# Altium schematic sheet IP Camera v0.0.1_periphery.SchDoc
size 427 x 301 mm; Organization: нижняя строка названия; Address1: Прошутинский; Address2: Шелестов; Address3: Н.Контр; Address4: Утвердил; DocumentNumber: IP камера Э3; SheetNumber: 1; SheetTotal: 5; Address5: МГТУ им. Н. Э. Баумана; Address6: Кафедра РЛ2; Address7: Группа РЛ2-81; Scale: 1:1
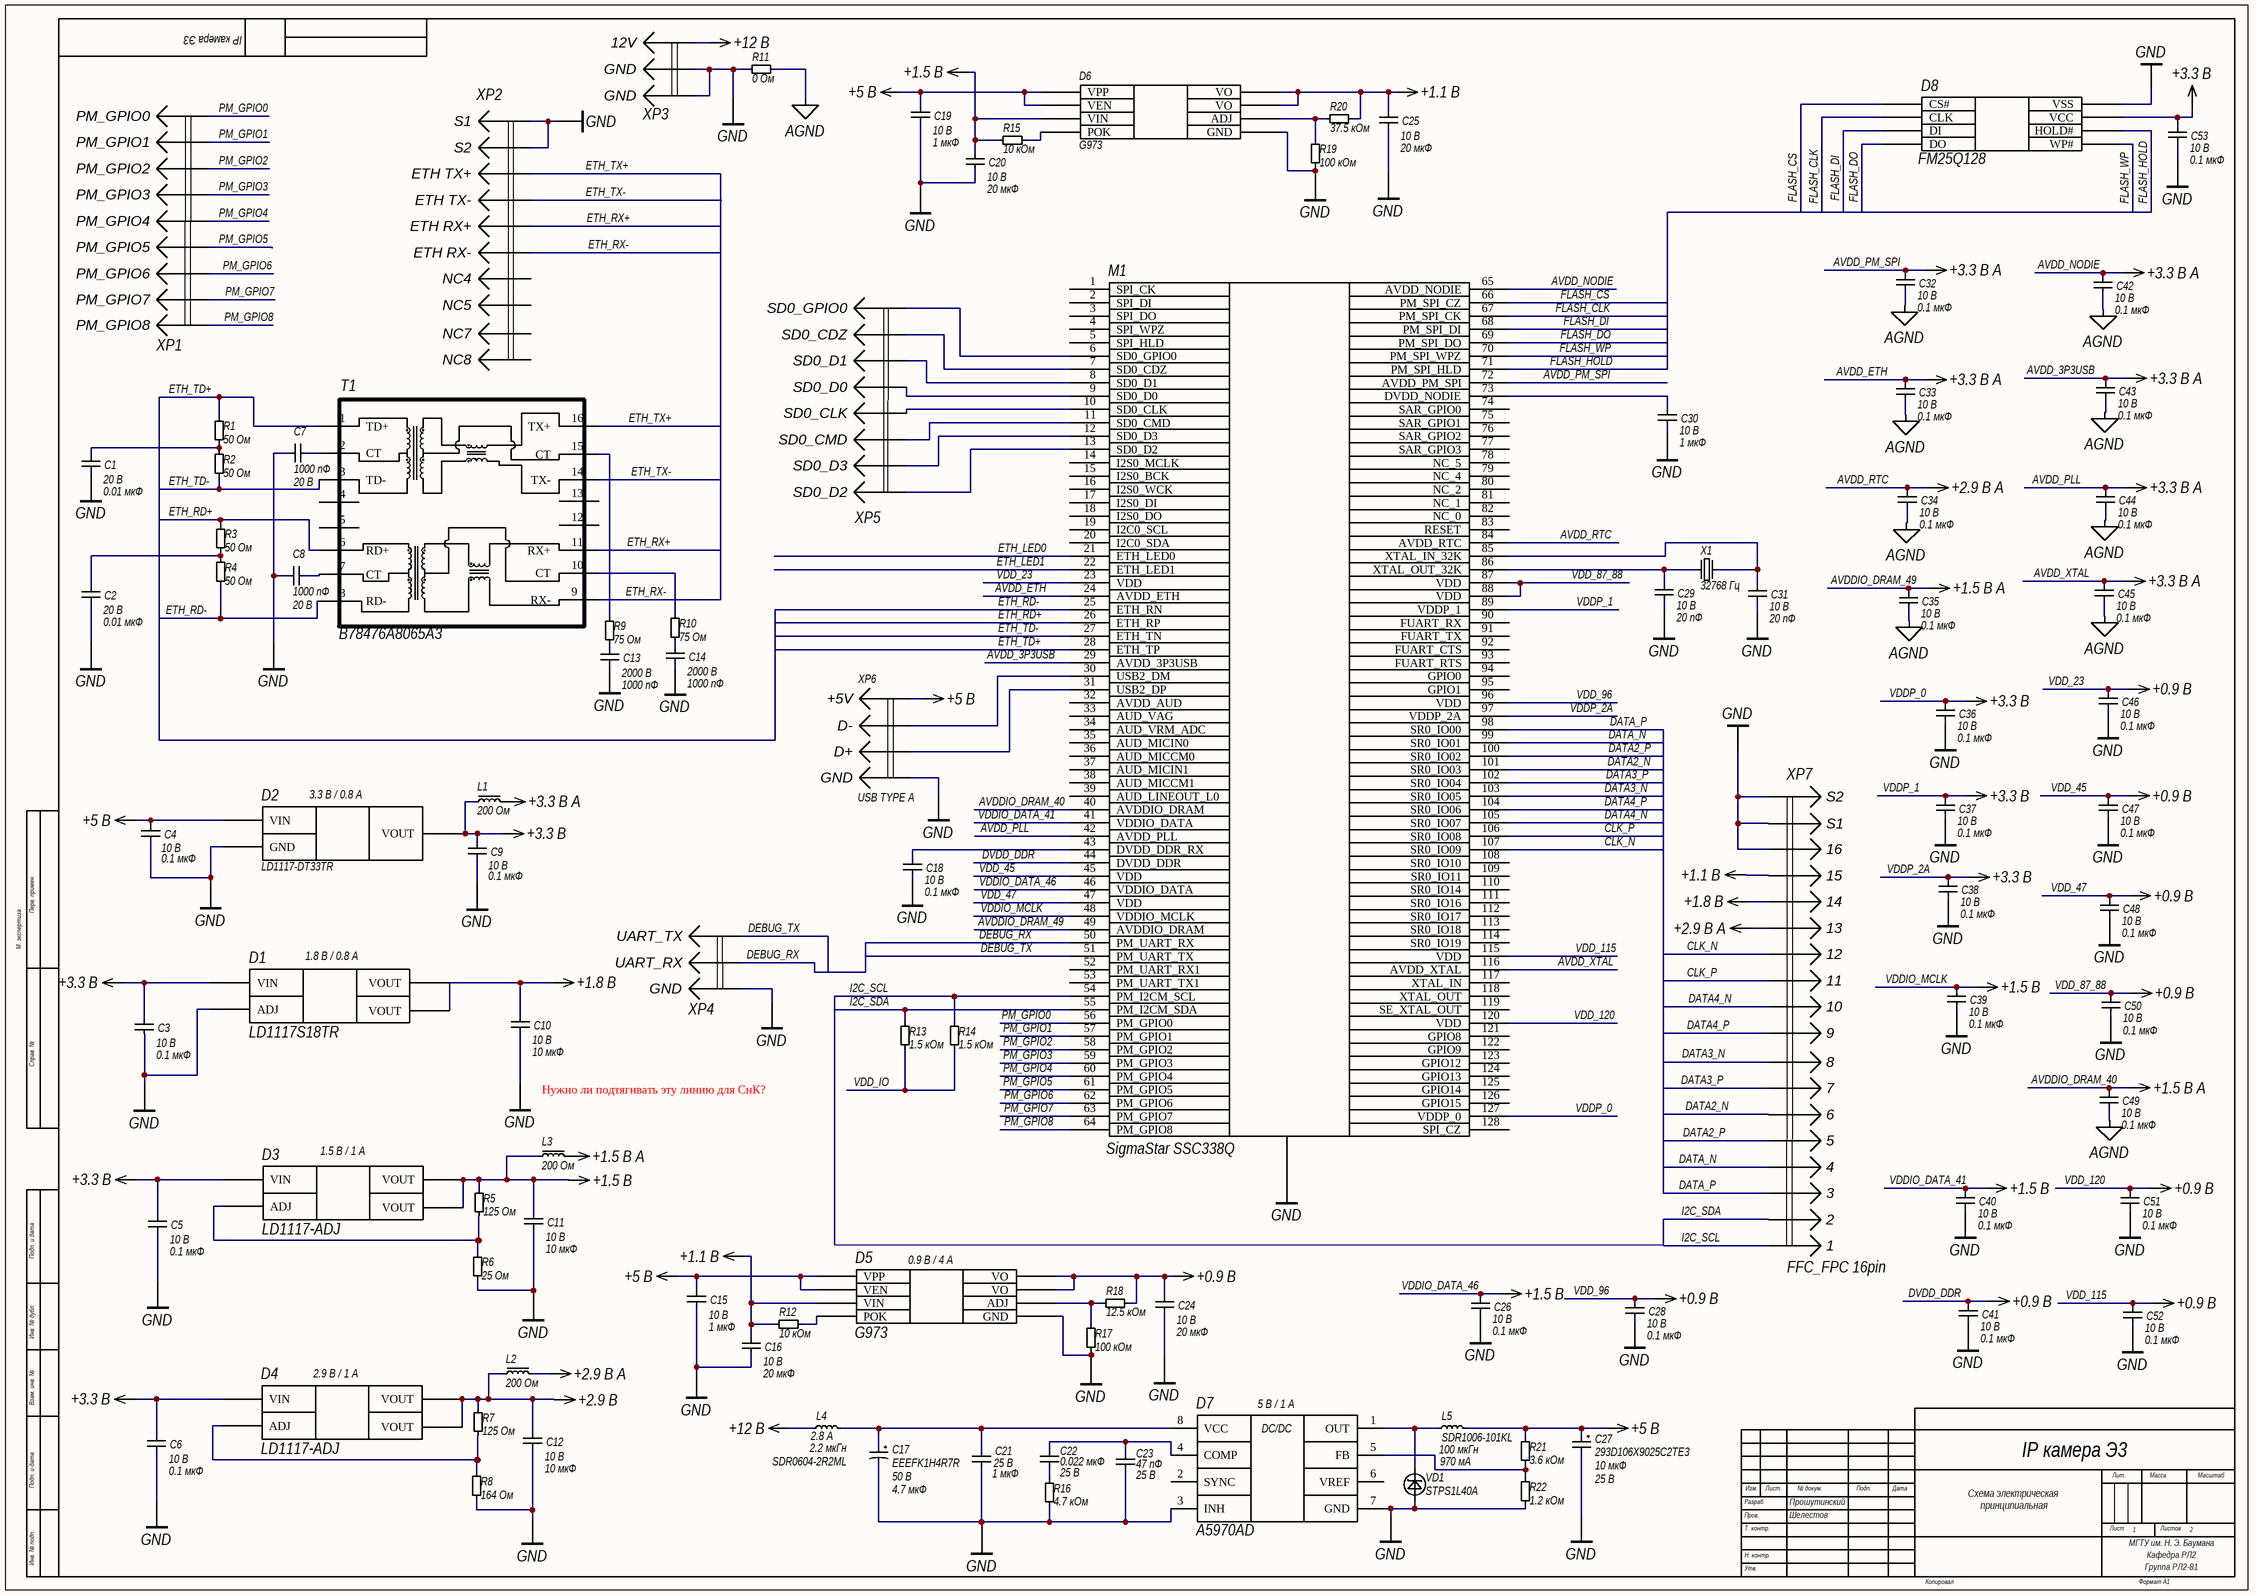
[diagram p0: IP Camera v0.0.1_periphery.SchDoc]

## Parts
C1  Voltage: 20 В  [CAP0603]  (hidden comment: 0.01 мкФ)
C2  Voltage: 20 В  [CAP0603]  (hidden comment: 0.01 мкФ)
C3  Voltage: 10 В  [CAP0603]  (hidden comment: 0.1 мкФ)
C4  Voltage: 10 В  [CAP0603]  (hidden comment: 0.1 мкФ)
C5  Voltage: 10 В  [CAP0603]  (hidden comment: 0.1 мкФ)
C6  Voltage: 10 В  [CAP0603]  (hidden comment: 0.1 мкФ)
C7  Voltage: 20 В  [CAP0603]  (hidden comment: 1000 пФ)
C8  Voltage: 20 В  [CAP0603]  (hidden comment: 1000 пФ)
C9  Voltage: 10 В  [CAP0603]  (hidden comment: 0.1 мкФ)
C10  Voltage: 10 В  [CAP0603]  (hidden comment: 10 мкФ)
C11  Voltage: 10 В  [CAP0603]  (hidden comment: 10 мкФ)
C12  Voltage: 10 В  [CAP0603]  (hidden comment: 10 мкФ)
C13  Voltage: 2000 В  [CAP0603]  (hidden comment: 1000 пФ)
C14  Voltage: 2000 В  [CAP0603]  (hidden comment: 1000 пФ)
C15  Voltage: 10 В  [CAP0603]  (hidden comment: 1 мкФ)
C16  Voltage: 10 В  [CAP0603]  (hidden comment: 20 мкФ)
C17  EEEFK1H4R7R  Voltage: 50 В  Capacity: 4.7 мкФ  [EEEFK1H4R7R]
C18  Voltage: 10 В  [CAP0603]  (hidden comment: 0.1 мкФ)
C19  Voltage: 10 В  [CAP0603]  (hidden comment: 1 мкФ)
C20  Voltage: 10 В  [CAP0603]  (hidden comment: 20 мкФ)
C21  Voltage: 25 В  [CAP0603]  (hidden comment: 1 мкФ)
C22  Voltage: 25 В  [CAP0603]  (hidden comment: 0.022 мкФ)
C23  Voltage: 25 В  [CAP0603]  (hidden comment: 47 пФ)
C24  Voltage: 10 В  [CAP0603]  (hidden comment: 20 мкФ)
C25  Voltage: 10 В  [CAP0603]  (hidden comment: 20 мкФ)
C26  Voltage: 10 В  [CAP0603]  (hidden comment: 0.1 мкФ)
C27  293D106X9025C2TE3  Capacity: 10 мкФ  Voltage: 25 В  [TANTAL C]
C28  Voltage: 10 В  [CAP0603]  (hidden comment: 0.1 мкФ)
C29  Voltage: 10 В  [CAP0603]  (hidden comment: 20 пФ)
C30  Voltage: 10 В  [CAP0603]  (hidden comment: 1 мкФ)
C31  Voltage: 10 В  [CAP0603]  (hidden comment: 20 пФ)
C32  Voltage: 10 В  [CAP0603]  (hidden comment: 0.1 мкФ)
C33  Voltage: 10 В  [CAP0603]  (hidden comment: 0.1 мкФ)
C34  Voltage: 10 В  [CAP0603]  (hidden comment: 0.1 мкФ)
C35  Voltage: 10 В  [CAP0603]  (hidden comment: 0.1 мкФ)
C36  Voltage: 10 В  [CAP0603]  (hidden comment: 0.1 мкФ)
C37  Voltage: 10 В  [CAP0603]  (hidden comment: 0.1 мкФ)
C38  Voltage: 10 В  [CAP0603]  (hidden comment: 0.1 мкФ)
C39  Voltage: 10 В  [CAP0603]  (hidden comment: 0.1 мкФ)
C40  Voltage: 10 В  [CAP0603]  (hidden comment: 0.1 мкФ)
C41  Voltage: 10 В  [CAP0603]  (hidden comment: 0.1 мкФ)
C42  Voltage: 10 В  [CAP0603]  (hidden comment: 0.1 мкФ)
C43  Voltage: 10 В  [CAP0603]  (hidden comment: 0.1 мкФ)
C44  Voltage: 10 В  [CAP0603]  (hidden comment: 0.1 мкФ)
C45  Voltage: 10 В  [CAP0603]  (hidden comment: 0.1 мкФ)
C46  Voltage: 10 В  [CAP0603]  (hidden comment: 0.1 мкФ)
C47  Voltage: 10 В  [CAP0603]  (hidden comment: 0.1 мкФ)
C48  Voltage: 10 В  [CAP0603]  (hidden comment: 0.1 мкФ)
C49  Voltage: 10 В  [CAP0603]  (hidden comment: 0.1 мкФ)
C50  Voltage: 10 В  [CAP0603]  (hidden comment: 0.1 мкФ)
C51  Voltage: 10 В  [CAP0603]  (hidden comment: 0.1 мкФ)
C52  Voltage: 10 В  [CAP0603]  (hidden comment: 0.1 мкФ)
C53  Voltage: 10 В  [CAP0603]  (hidden comment: 0.1 мкФ)
D1  LD1117S18TR  [SOT-223]
D2  LD1117-DT33TR  [D-PAK]
D3  LD1117-ADJ  [SOT-223]
D4  LD1117-ADJ  [SOT-223]
D5  G973  [SOP-8]
D6  G973  [SOP-8]
D7  A5970AD  [SOIC-8]
D8  FM25Q128  [SOP-8]
L1  value 200 Ом  [FERRITE0603]  (hidden comment: FERRITE0603)
L2  value 200 Ом  [FERRITE0603]  (hidden comment: FERRITE0603)
L3  value 200 Ом  [FERRITE0603]  (hidden comment: FERRITE0603)
L4  SDR0604-2R2ML  Current: 2.8 А  Inductance: 2.2 мкГн  [SDR0604-2R2ML]
L5  SDR1006-101KL  value 100 мкГн  current: 970 мА  [SDR1006-101KL]
M1  SigmaStar SSC338Q  [QFN-128]
R1  value 50 Ом  [RES0603]  (hidden comment: RES)
R2  value 50 Ом  [RES0603]  (hidden comment: RES)
R3  value 50 Ом  [RES0603]  (hidden comment: RES)
R4  value 50 Ом  [RES0603]  (hidden comment: RES)
R5  value 125 Ом  [RES0603]  (hidden comment: RES)
R6  value 25 Ом  [RES0603]  (hidden comment: RES)
R7  value 125 Ом  [RES0603]  (hidden comment: RES)
R8  value 164 Ом  [RES0603]  (hidden comment: RES)
R9  value 75 Ом  [RES0603]  (hidden comment: RES)
R10  value 75 Ом  [RES0603]  (hidden comment: RES)
R11  value 0 Ом  [RES0603]  (hidden comment: RES)
R12  value 10 кОм  [RES0603]  (hidden comment: RES)
R13  value 1.5 кОм  [RES0603]  (hidden comment: RES)
R14  value 1.5 кОм  [RES0603]  (hidden comment: RES)
R15  value 10 кОм  [RES0603]  (hidden comment: RES)
R16  value 4.7 кОм  [RES0603]  (hidden comment: RES)
R17  value 100 кОм  [RES0603]  (hidden comment: RES)
R18  value 12.5 кОм  [RES0603]  (hidden comment: RES)
R19  value 100 кОм  [RES0603]  (hidden comment: RES)
R20  value 37.5 кОм  [RES0603]  (hidden comment: RES)
R21  value 3.6 кОм  [RES0603]  (hidden comment: RES)
R22  value 1.2 кОм  [RES0603]  (hidden comment: RES)
T1  B78476A8065A3  [SOP-16]
VD1  STPS1L40A  [DO-214AC]
X1  value 32768 Гц  (hidden comment: XTAL)
XP1  J4  [J4]  (value not drawn)
XP2  J1  [RJHSE-5E80]  (value not drawn)
XP3  DS-261A  [DS-261A]  (value not drawn)
XP4  J2  [J2]  (value not drawn)
XP5  J6  [J6]  (value not drawn)
XP6  USB TYPE A  [USB TYPE A]
XP7  FFC_FPC 16pin  [FFC_FPC 16pin]

## Nets
+1.1 В: C16.1 C25.1 D5.5(VIN) D6.3(VO) D6.4(VO) R12.2 R20.2 XP7.15
+1.8 В: C10.1 D1.2(VOUT) D1.4(VOUT) XP7.14
+2.9 В: C12.1 D4.2(VOUT) D4.4(VOUT) L2.1 R7.2
+5 В: C4.1 C15.1 C19.1 C27.1 D2.3(VIN) D5.6(VPP) D5.8(VEN) D6.6(VPP) D6.8(VEN) L5.2 R21.1 XP6.1(+5V)
+12 В: L4.1 XP3.1(12V)
AGND: C32.2 C33.2 C34.2 C35.2 C42.2 C43.2 C44.2 C45.2 C49.2 R11.1
AVDD_3P3USB: C32.1 C33.1 C42.1 C43.1 C44.1 C45.1 L1.2 M1.24(AVDD_ETH) M1.29(AVDD_3P3USB) M1.42(AVDD_PLL) M1.65(AVDD_NODIE) M1.72(AVDD_PM_SPI) M1.116(AVDD_XTAL)  [also labelled +3.3 В А, AVDD_ETH, AVDD_NODIE, AVDD_PLL, AVDD_PM_SPI, AVDD_XTAL]
AVDD_RTC: C34.1 L2.2 M1.84(AVDD_RTC) XP7.13  [also labelled +2.9 В А]
AVDDIO_DRAM_40: C35.1 C49.1 L3.2 M1.40(AVDDIO_DRAM) M1.49(AVDDIO_DRAM)  [also labelled +1.5 В А, AVDDIO_DRAM_49]
DVDD_DDR: C24.1 C28.1 C41.1 C46.1 C47.1 C48.1 C50.1 C51.1 C52.1 D5.3(VO) D5.4(VO) M1.23(VDD) M1.44(DVDD_DDR) M1.45(VDD) M1.47(VDD) M1.87(VDD) M1.88(VDD) M1.96(VDD) M1.115(VDD) M1.120(VDD) R18.2  [also labelled +0.9 В, VDD_115, VDD_120, VDD_23, VDD_45, VDD_47, VDD_87_88, VDD_96]
GND: C1.2 C2.2 C3.2 C4.2 C5.2 C6.2 C7.1 C8.1 C9.2 C10.2 C11.2 C12.2 C13.2 C14.2 C15.2 C16.2 C17.2 C18.2 C19.2 C20.2 C21.2 C23.1 C24.2 C25.2 C26.2 C27.2 C28.2 C29.2 C30.2 C31.2 C36.2 C37.2 C38.2 C39.2 C40.2 C41.2 C46.2 C47.2 C48.2 C50.2 C51.2 C52.2 C53.2 D1.1(ADJ) D2.1(GND) D5.1(GND) D6.1(GND) D7.3(INH) D7.7(GND) D8.4(VSS) M1.129(GND) R6.1 R8.1 R11.2 R16.2 R17.2 R19.2 R22.2 VD1.1 XP2.S1 XP2.S2 XP3.2(GND) XP3.3(GND) XP4.3(GND) XP6.4(GND) XP7.16 XP7.S1 XP7.S2
VDDIO_DATA_41: C11.1 C20.1 C26.1 C39.1 C40.1 D3.2(VOUT) D3.4(VOUT) D6.5(VIN) L3.1 M1.41(VDDIO_DATA) M1.46(VDDIO_DATA) M1.48(VDDIO_MCLK) R5.2 R15.2  [also labelled +1.5 В, VDDIO_DATA_46, VDDIO_MCLK]
VDDP_0: C3.1 C5.1 C6.1 C9.1 C36.1 C37.1 C38.1 C53.1 D1.3(VIN) D2.2(VOUT) D3.3(VIN) D4.3(VIN) D8.8(VCC) L1.1 M1.89(VDDP_1) M1.97(VDDP_2A) M1.127(VDDP_0)  [also labelled +3.3 В, VDDP_1, VDDP_2A]
CLK_N: M1.107(SR0_IO09) XP7.12
CLK_P: M1.106(SR0_IO08) XP7.11
DATA2_N: M1.101(SR0_IO03) XP7.6
DATA2_P: M1.100(SR0_IO02) XP7.5
DATA3_N: M1.103(SR0_IO05) XP7.8
DATA3_P: M1.102(SR0_IO04) XP7.7
DATA4_N: M1.105(SR0_IO07) XP7.10
DATA4_P: M1.104(SR0_IO06) XP7.9
DATA_N: M1.99(SR0_IO01) XP7.4
DATA_P: M1.98(SR0_IO00) XP7.3
DEBUG_RX: M1.50(PM_UART_RX) XP4.2(UART_RX)
DEBUG_TX: M1.51(PM_UART_TX) XP4.1(UART_TX)
ETH_LED0: M1.21(ETH_LED0)
ETH_LED1: M1.22(ETH_LED1)
ETH_RD+: M1.26(ETH_RP) R3.1 T1.6(RD+)
ETH_RD-: M1.25(ETH_RN) R4.2 T1.8(RD-)
ETH_RX+: T1.11(RX+) XP2.3(ETH_RX+)
ETH_RX-: T1.9(RX-) XP2.6(ETH_RX-)
ETH_TD+: M1.28(ETH_TP) R1.1 T1.1
ETH_TD-: M1.27(ETH_TN) R2.2 T1.3(TD-)
ETH_TX+: T1.16(TX+) XP2.1(ETH_TX+)
ETH_TX-: T1.14(TX-) XP2.2(ETH_TX-)
FLASH_CLK: D8.6(CLK) M1.67(PM_SPI_CK)
FLASH_CS: D8.1(CS#) M1.66(PM_SPI_CZ)
FLASH_DI: D8.5(DI) M1.68(PM_SPI_DI)
FLASH_DO: D8.2(DO) M1.69(PM_SPI_DO)
FLASH_HOLD: D8.7(HOLD#) M1.71(PM_SPI_HLD)
FLASH_WP: D8.3(WP#) M1.70(PM_SPI_WPZ)
I2C_SCL: M1.54(PM_I2CM_SCL) R14.2 XP7.1
I2C_SDA: M1.55(PM_I2CM_SDA) R13.2 XP7.2
PM_GPIO0: M1.56(PM_GPIO0) XP1.1(PM_GPIO0)
PM_GPIO1: M1.57(PM_GPIO1) XP1.2(PM_GPIO1)
PM_GPIO2: M1.58(PM_GPIO2) XP1.3(PM_GPIO2)
PM_GPIO3: M1.59(PM_GPIO3) XP1.4(PM_GPIO3)
PM_GPIO4: M1.60(PM_GPIO4) XP1.5(PM_GPIO4)
PM_GPIO5: M1.61(PM_GPIO5) XP1.6(PM_GPIO5)
PM_GPIO6: M1.62(PM_GPIO6) XP1.7(PM_GPIO6)
PM_GPIO7: M1.63(PM_GPIO7) XP1.8(PM_GPIO7)
PM_GPIO8: M1.64(PM_GPIO8) XP1.9(PM_GPIO8)
VDD_IO: R13.1 R14.1
NetC1_1: C1.1 R1.2 R2.1
NetC2_1: C2.1 R3.2 R4.1
NetC7_2: C7.2 T1.2(CT)
NetC8_2: C8.2 T1.7(CT)
NetC13_1: C13.1 R9.2
NetC14_1: C14.1 R10.2
NetC17_1: C17.1 C21.1 D7.8(VCC) L4.2
NetC18_1: C18.1 M1.43(DVDD_DDR_RX)
NetC22_1: C22.1 R16.1
NetC22_2: C22.2 C23.2 D7.4(COMP)
NetC29_1: C29.1 M1.86(XTAL_OUT_32K) X1.1
NetC30_1: C30.1 M1.73(DVDD_NODIE)
NetC31_1: C31.1 M1.85(XTAL_IN_32K) X1.2
NetD3_1: D3.1(ADJ) R5.1 R6.2
NetD4_1: D4.1(ADJ) R7.1 R8.2
NetD5_2: D5.2(ADJ) R17.1 R18.1
NetD5_7: D5.7(POK) R12.1
NetD6_2: D6.2(ADJ) R19.1 R20.1
NetD6_7: D6.7(POK) R15.1
NetD7_1: D7.1(OUT) L5.1 VD1.2
NetD7_5: D7.5(FB) R21.2 R22.1
NetM1_6: M1.6(SD0_GPIO0) XP5.1(SD0_GPIO0)
NetM1_7: M1.7(SD0_CDZ) XP5.2(SD0_CDZ)
NetM1_8: M1.8(SD0_D1) XP5.3(SD0_D1)
NetM1_9: M1.9(SD0_D0) XP5.4(SD0_D0)
NetM1_10: M1.10(SD0_CLK) XP5.5(SD0_CLK)
NetM1_11: M1.11(SD0_CMD) XP5.6(SD0_CMD)
NetM1_12: M1.12(SD0_D3) XP5.7(SD0_D3)
NetM1_13: M1.13(SD0_D2) XP5.8(SD0_D2)
NetM1_30: M1.30(USB2_DM) XP6.2(D-)
NetM1_31: M1.31(USB2_DP) XP6.3(D+)
NetR9_1: R9.1 T1.15(CT)
NetR10_1: R10.1 T1.10(CT)

Not connected (* = marked no-connect by the designer): D7 2(SYNC) 6(VREF); M1 1(SPI_CK) 2(SPI_DI) 3(SPI_DO) 4(SPI_WPZ) 5(SPI_HLD) 14(I2S0_MCLK) 15(I2S0_BCK) 16(I2S0_WCK) 17(I2S0_DI) 18(I2S0_DO) 19(I2C0_SCL) 20(I2C0_SDA) 32(AVDD_AUD) 33(AUD_VAG) 34(AUD_VRM_ADC) 35(AUD_MICIN0) 36(AUD_MICCM0) 37(AUD_MICIN1) 38(AUD_MICCM1) 39(AUD_LINEOUT_L0) 52(PM_UART_RX1) 53(PM_UART_TX1) 74(SAR_GPIO0) 75(SAR_GPIO1) 76(SAR_GPIO2) 77(SAR_GPIO3) 78(NC_5) 79(NC_4) 80(NC_2) 81(NC_1) 82(NC_0) 83(RESET) 90(FUART_RX) 91(FUART_TX) 92(FUART_CTS) 93(FUART_RTS) 94(GPIO0) 95(GPIO1) 108(SR0_IO10) 109(SR0_IO11) 110(SR0_IO14) 111(SR0_IO16) 112(SR0_IO17) 113(SR0_IO18) 114(SR0_IO19) 117(XTAL_IN) 118(XTAL_OUT) 119(SE_XTAL_OUT) 121(GPIO8) 122(GPIO9) 123(GPIO12) 124(GPIO13) 125(GPIO14) 126(GPIO15) 128(SPI_CZ); T1 4(NC) 5 12(NC) 13(NC); XP2 4(NC4) 5(NC5) 7(NC7) 8(NC8)

## Notes on the sheet
- (near D2) 3.3 В / 0.8 А
- (near D1) 1.8 В / 0.8 А
- Нужно ли подтягивать эту линию для СнК?
- (near D3) 1.5 В / 1 А
- (near D5) 0.9 В / 4 А
- (near D4) 2.9 В / 1 А
- (near D7) 5 В / 1 А
- М. экспертиза
- Перв. примен.
- Справ. №
- Подп. и дата
- Инв. № дубл.
- Взам. инв. №
- Лит.
- Масса
- Масштаб
- Разраб.
- Пров.
- Т. контр.
- Изм.
- Лист.
- № докум.
- Подп.
- Дата
- Схема электрическая
- принципиальная
- Лист
- Листов
- 2
- Инв. № подп.
- Н. контр.
- Утв.
- Копировал
- Формат А1
- (in symbol A5970AD) DC/DC

## Library data of the parts
C1-C3 C5-C8 C10-C16 C18-C26 C28-C53 = CAP_CERAMIC
  C1 C2: Value: 0.01 мкФ
  C3 C5 C6 C18 C26 C28 C32-C53: Value: 0.1 мкФ
  C7 C8 C13 C14: Value: 1000 пФ
  C10-C12: Value: 10 мкФ
  C15 C19 C21 C30: Value: 1 мкФ
  C16 C20 C24 C25: Value: 20 мкФ
  C22: Value: 0.022 мкФ
  C23: Value: 47 пФ
  C29 C31: Value: 20 пФ
C4 C9 = CAP0603: Value: 0.1 мкФ
D1 = LD1117-ADJ
XP3 = J5
XP6 = J7
XP7 = J3 CAM